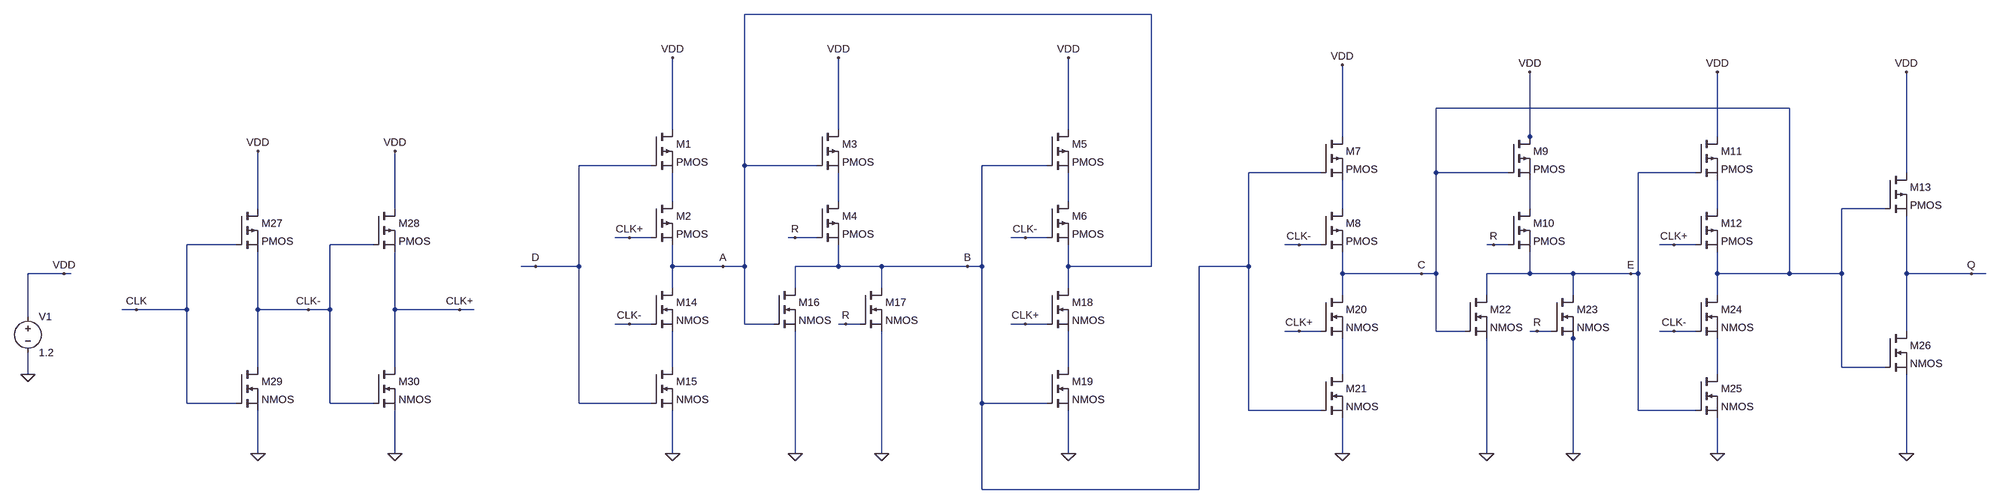
[diagram p0: schematic dff_schematic.asc]
dff_schematic.asc, the LTspice schematic file:
Version 4.1
SHEET 1 2788 1204
WIRE 784 -816 -128 -816
WIRE 2240 -608 1456 -608
WIRE -288 -560 -288 -720
WIRE 80 -560 80 -720
WIRE 592 -560 592 -720
WIRE 1248 -544 1248 -704
WIRE 1664 -544 1664 -688
WIRE 2080 -544 2080 -688
WIRE 1664 -528 1664 -544
WIRE -336 -480 -496 -480
WIRE -128 -480 -128 -816
WIRE 32 -480 -128 -480
WIRE 544 -480 400 -480
WIRE 1200 -464 1040 -464
WIRE 1456 -464 1456 -608
WIRE 1616 -464 1456 -464
WIRE 2032 -464 1904 -464
WIRE 2608 -464 2608 -688
WIRE -288 -400 -288 -464
WIRE 80 -400 80 -464
WIRE 592 -400 592 -464
WIRE -1248 -384 -1248 -512
WIRE -944 -384 -944 -512
WIRE 1248 -384 1248 -448
WIRE 1664 -384 1664 -448
WIRE 2080 -384 2080 -448
WIRE 2560 -384 2464 -384
WIRE -384 -320 -416 -320
WIRE -336 -320 -384 -320
WIRE -16 -320 -32 -320
WIRE 32 -320 -16 -320
WIRE 496 -320 464 -320
WIRE 544 -320 496 -320
WIRE -1296 -304 -1424 -304
WIRE -992 -304 -1088 -304
WIRE 1152 -304 1120 -304
WIRE 1200 -304 1152 -304
WIRE 1584 -304 1568 -304
WIRE 1616 -304 1584 -304
WIRE 1984 -304 1952 -304
WIRE 2032 -304 1984 -304
WIRE -592 -256 -624 -256
WIRE -496 -256 -496 -480
WIRE -496 -256 -592 -256
WIRE -288 -256 -288 -304
WIRE -176 -256 -288 -256
WIRE -128 -256 -128 -480
WIRE -128 -256 -176 -256
WIRE 80 -256 80 -304
WIRE 80 -256 -16 -256
WIRE 176 -256 80 -256
WIRE 368 -256 176 -256
WIRE 400 -256 400 -480
WIRE 400 -256 368 -256
WIRE 592 -256 592 -304
WIRE 784 -256 784 -816
WIRE 784 -256 592 -256
WIRE 1040 -256 1040 -464
WIRE 1040 -256 928 -256
WIRE -1760 -240 -1840 -240
WIRE -1744 -240 -1760 -240
WIRE 1248 -240 1248 -288
WIRE 1424 -240 1248 -240
WIRE 1456 -240 1456 -464
WIRE 1456 -240 1424 -240
WIRE 1664 -240 1664 -288
WIRE 1664 -240 1568 -240
WIRE 1760 -240 1664 -240
WIRE 1888 -240 1760 -240
WIRE 1904 -240 1904 -464
WIRE 1904 -240 1888 -240
WIRE 2080 -240 2080 -288
WIRE 2240 -240 2240 -608
WIRE 2240 -240 2080 -240
WIRE 2464 -240 2464 -384
WIRE 2464 -240 2240 -240
WIRE 2608 -240 2608 -368
WIRE 2752 -240 2608 -240
WIRE 2784 -240 2752 -240
WIRE -288 -208 -288 -256
WIRE -16 -208 -16 -256
WIRE 176 -208 176 -256
WIRE 592 -208 592 -256
WIRE 1248 -192 1248 -240
WIRE 1568 -192 1568 -240
WIRE 1760 -192 1760 -240
WIRE 2080 -192 2080 -240
WIRE -1536 -160 -1568 -160
WIRE -1424 -160 -1424 -304
WIRE -1424 -160 -1536 -160
WIRE -1248 -160 -1248 -288
WIRE -1136 -160 -1248 -160
WIRE -1088 -160 -1088 -304
WIRE -1088 -160 -1136 -160
WIRE -944 -160 -944 -288
WIRE -800 -160 -944 -160
WIRE -768 -160 -800 -160
WIRE -1840 -144 -1840 -240
WIRE -384 -128 -416 -128
WIRE -336 -128 -384 -128
WIRE -128 -128 -128 -256
WIRE -64 -128 -128 -128
WIRE 96 -128 80 -128
WIRE 128 -128 96 -128
WIRE 496 -128 464 -128
WIRE 544 -128 496 -128
WIRE 1152 -112 1120 -112
WIRE 1200 -112 1152 -112
WIRE 1456 -112 1456 -240
WIRE 1520 -112 1456 -112
WIRE 1680 -112 1664 -112
WIRE 1712 -112 1680 -112
WIRE 1984 -112 1952 -112
WIRE 2032 -112 1984 -112
WIRE 2608 -112 2608 -240
WIRE 1760 -96 1760 -112
WIRE -1248 -32 -1248 -160
WIRE -944 -32 -944 -160
WIRE -288 -32 -288 -112
WIRE 592 -32 592 -112
WIRE 2464 -32 2464 -240
WIRE 2560 -32 2464 -32
WIRE -1840 -16 -1840 -64
WIRE 1248 -16 1248 -96
WIRE 2080 -16 2080 -96
WIRE -1424 48 -1424 -160
WIRE -1296 48 -1424 48
WIRE -1088 48 -1088 -160
WIRE -992 48 -1088 48
WIRE -496 48 -496 -256
WIRE -336 48 -496 48
WIRE 400 48 400 -256
WIRE 544 48 400 48
WIRE 1040 64 1040 -256
WIRE 1200 64 1040 64
WIRE 1904 64 1904 -240
WIRE 2032 64 1904 64
WIRE -1248 160 -1248 64
WIRE -944 160 -944 64
WIRE -288 160 -288 64
WIRE -16 160 -16 -112
WIRE 176 160 176 -112
WIRE 592 160 592 64
WIRE 1248 160 1248 80
WIRE 1568 160 1568 -96
WIRE 1760 160 1760 -96
WIRE 2080 160 2080 80
WIRE 2608 160 2608 -16
WIRE 400 240 400 48
WIRE 928 240 928 -256
WIRE 928 240 400 240
FLAG -1840 -16 0
FLAG -1760 -240 VDD
FLAG -1248 -512 VDD
FLAG -944 -512 VDD
FLAG -1248 160 0
FLAG -944 160 0
FLAG -1536 -160 CLK
FLAG -1136 -160 CLK-
FLAG -800 -160 CLK+
FLAG -384 -320 CLK+
FLAG 496 -320 CLK-
FLAG -384 -128 CLK-
FLAG 496 -128 CLK+
FLAG -288 160 0
FLAG 592 160 0
FLAG -288 -720 VDD
FLAG 592 -720 VDD
FLAG -16 160 0
FLAG 176 160 0
FLAG 80 -720 VDD
FLAG -592 -256 D
FLAG -176 -256 A
FLAG 368 -256 B
FLAG 1152 -304 CLK-
FLAG 1152 -112 CLK+
FLAG 1248 160 0
FLAG 1248 -704 VDD
FLAG 1568 160 0
FLAG 1760 160 0
FLAG 1664 -688 VDD
FLAG -16 -320 R
FLAG 96 -128 R
FLAG 1584 -304 R
FLAG 1680 -112 R
FLAG 1984 -304 CLK+
FLAG 1984 -112 CLK-
FLAG 2080 160 0
FLAG 2080 -688 VDD
FLAG 2608 -688 VDD
FLAG 2608 160 0
FLAG 2752 -240 Q
FLAG 1424 -240 C
FLAG 1888 -240 E
SYMBOL nmos -336 -208 R0
SYMATTR InstName M14
SYMBOL nmos -336 -32 R0
SYMATTR InstName M15
SYMBOL nmos 544 -32 R0
SYMATTR InstName M19
SYMBOL nmos 544 -208 R0
SYMATTR InstName M18
SYMBOL pmos -336 -560 R0
SYMATTR InstName M1
SYMBOL pmos -336 -400 R0
SYMATTR InstName M2
SYMBOL pmos 544 -560 R0
SYMATTR InstName M5
SYMBOL pmos 544 -400 R0
SYMATTR InstName M6
SYMBOL nmos -992 -32 R0
SYMATTR InstName M30
SYMBOL pmos -992 -384 R0
SYMATTR InstName M28
SYMBOL pmos -1296 -384 R0
SYMATTR InstName M27
SYMBOL nmos -1296 -32 R0
SYMATTR InstName M29
SYMBOL voltage -1840 -160 R0
SYMATTR InstName V1
SYMATTR Value 1.2
SYMBOL pmos 32 -560 R0
SYMATTR InstName M3
SYMBOL pmos 32 -400 R0
SYMATTR InstName M4
SYMBOL nmos 128 -208 R0
SYMATTR InstName M17
SYMBOL nmos -64 -208 R0
SYMATTR InstName M16
SYMBOL nmos 1200 -192 R0
SYMATTR InstName M20
SYMBOL nmos 1200 -16 R0
SYMATTR InstName M21
SYMBOL pmos 1200 -544 R0
SYMATTR InstName M7
SYMBOL pmos 1200 -384 R0
SYMATTR InstName M8
SYMBOL pmos 1616 -544 R0
SYMATTR InstName M9
SYMBOL pmos 1616 -384 R0
SYMATTR InstName M10
SYMBOL nmos 1712 -192 R0
SYMATTR InstName M23
SYMBOL nmos 1520 -192 R0
SYMATTR InstName M22
SYMBOL nmos 2032 -192 R0
SYMATTR InstName M24
SYMBOL nmos 2032 -16 R0
SYMATTR InstName M25
SYMBOL pmos 2032 -544 R0
SYMATTR InstName M11
SYMBOL pmos 2032 -384 R0
SYMATTR InstName M12
SYMBOL nmos 2560 -112 R0
SYMATTR InstName M26
SYMBOL pmos 2560 -464 R0
SYMATTR InstName M13

The netlist it stands for:
* dff_schematic.asc
M14 A CLK- N007 N007 NMOS
M15 N007 D 0 0 NMOS
M19 N008 B 0 0 NMOS
M18 A CLK+ N008 N008 NMOS
M1 VDD D N001 N001 PMOS
M2 N001 CLK+ A A PMOS
M5 VDD B N003 N003 PMOS
M6 N003 CLK- A A PMOS
M30 CLK+ CLK- 0 0 NMOS
M28 VDD CLK- CLK+ CLK+ PMOS
M27 VDD CLK CLK- CLK- PMOS
M29 CLK- CLK 0 0 NMOS
V1 VDD 0 1.2
M3 VDD A N002 N002 PMOS
M4 N002 R B B PMOS
M17 B R 0 0 NMOS
M16 B A 0 0 NMOS
M20 C CLK+ N009 N009 NMOS
M21 N009 B 0 0 NMOS
M7 VDD B N004 N004 PMOS
M8 N004 CLK- C C PMOS
M9 VDD C N005 N005 PMOS
M10 N005 R E E PMOS
M23 E R 0 0 NMOS
M22 E C 0 0 NMOS
M24 C CLK- N010 N010 NMOS
M25 N010 E 0 0 NMOS
M11 VDD E N006 N006 PMOS
M12 N006 CLK+ C C PMOS
M26 Q C 0 0 NMOS
M13 VDD C Q Q PMOS
.model NMOS NMOS
.model PMOS PMOS
.lib standard.mos
.backanno
.end